# Altium schematic sheet logica de arranque.SchDoc
size A4
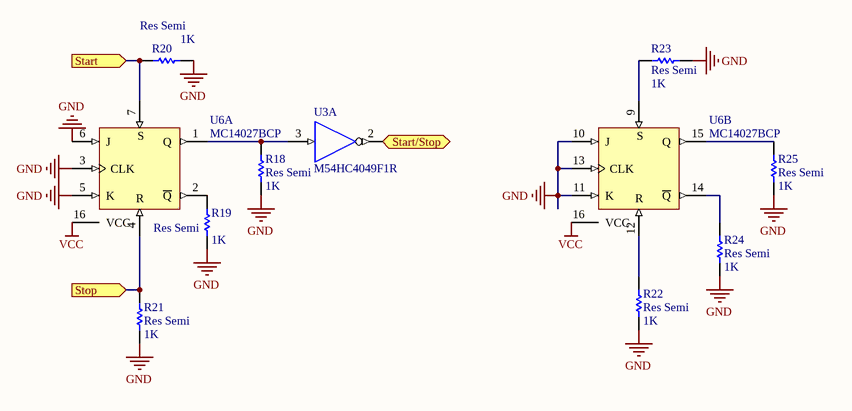
[diagram p0: logica de arranque.SchDoc]

## Parts
R18  Res Semi  value 1K  [2012[0805]]
R19  Res Semi  value 1K  [2012[0805]]
R20  Res Semi  value 1K  [2012[0805]]
R21  Res Semi  value 1K  [2012[0805]]
R22  Res Semi  value 1K  [2012[0805]]
R23  Res Semi  value 1K  [2012[0805]]
R24  Res Semi  value 1K  [2012[0805]]
R25  Res Semi  value 1K  [2012[0805]]
U3  M54HC4049F1R  [DIP16]  (part A of 6)
U6  MC14027BCP  [648-08]  (parts A,B of 2)

## Ports
Start (in), Start/Stop (out), Stop (in)

## Nets
GND: R18.2 R19.1 R20.2 R21.1 R22.1 R23.2 R24.1 R25.1 U3.8(GND) U6.3(CLK) U6.5(K) U6.6(J) U6.8(GND) U6.10(J) U6.11(K) U6.13(CLK)
VCC: U3.1(VCC) U6.16(VCC)
Start: R20.1 U6.7(S) ; port Start
Start/Stop: U3.2(Y) ; port Start/Stop
Stop: R21.2 U6.4(R) ; port Stop
NetR18_1: R18.1 U3.3(A) U6.1(Q)
NetR19_2: R19.2 U6.2(~{Q})
NetR22_2: R22.2 U6.12(R)
NetR23_1: R23.1 U6.9(S)
NetR24_2: R24.2 U6.14(~{Q})
NetR25_2: R25.2 U6.15(Q)

## Library data of the parts
R18-R25 = Res Semi: Semiconductor Resistor; Published: 8-Jun-2000; LatestRevisionDate: 17-Jul-2002; LatestRevisionNote: Re-released for DXP Platform.; PackageReference: AXIAL-0.5; Publisher: Altium Limited
U3 = M54HC4049F1R: Hex Buffer/Converter Invertering; Note: Pins 13 and 16 are not connected and not drawn.; Published: 8-Jun-2000; LatestRevisionDate: 06-Jun-2005; LatestRevisionNote: Stylized 3D Model Added.; DatasheetVersion: Mar-1993; PackageVersion: Apr-1996; PackageReference: DIP16; Publisher: Altium Limited; PackageDescription: DIP; 16 Leads; Row Spacing 7.62 mm; Pitch 2.54 mm; ComponentLink1Description: Manufacturer Link; ComponentLink1URL: http://www.st.com/
U6 = MC14027BCP: Dual J-K Flip-Flop; Published: 15-Apr-2002; DatasheetVersion: 1995; PackageVersion: Apr-2000; PackageReference: 648-08; Publisher: Altium Limited; PackageDescription: DIP; 16 Leads; Row Spacing 7.62 mm; Pitch 2.54 mm; Code_JEDEC: MS-001-BB; ComponentLink1Description: Manufacturer Link; ComponentLink1URL: http://www.onsemi.com/; ComponentLink2Description: Datasheet; ComponentLink2URL: http://www.onsemi.com/pub/Collateral/MC14027B-D.PDF